# Altium schematic sheet USB-C PD.SchDoc
size A4
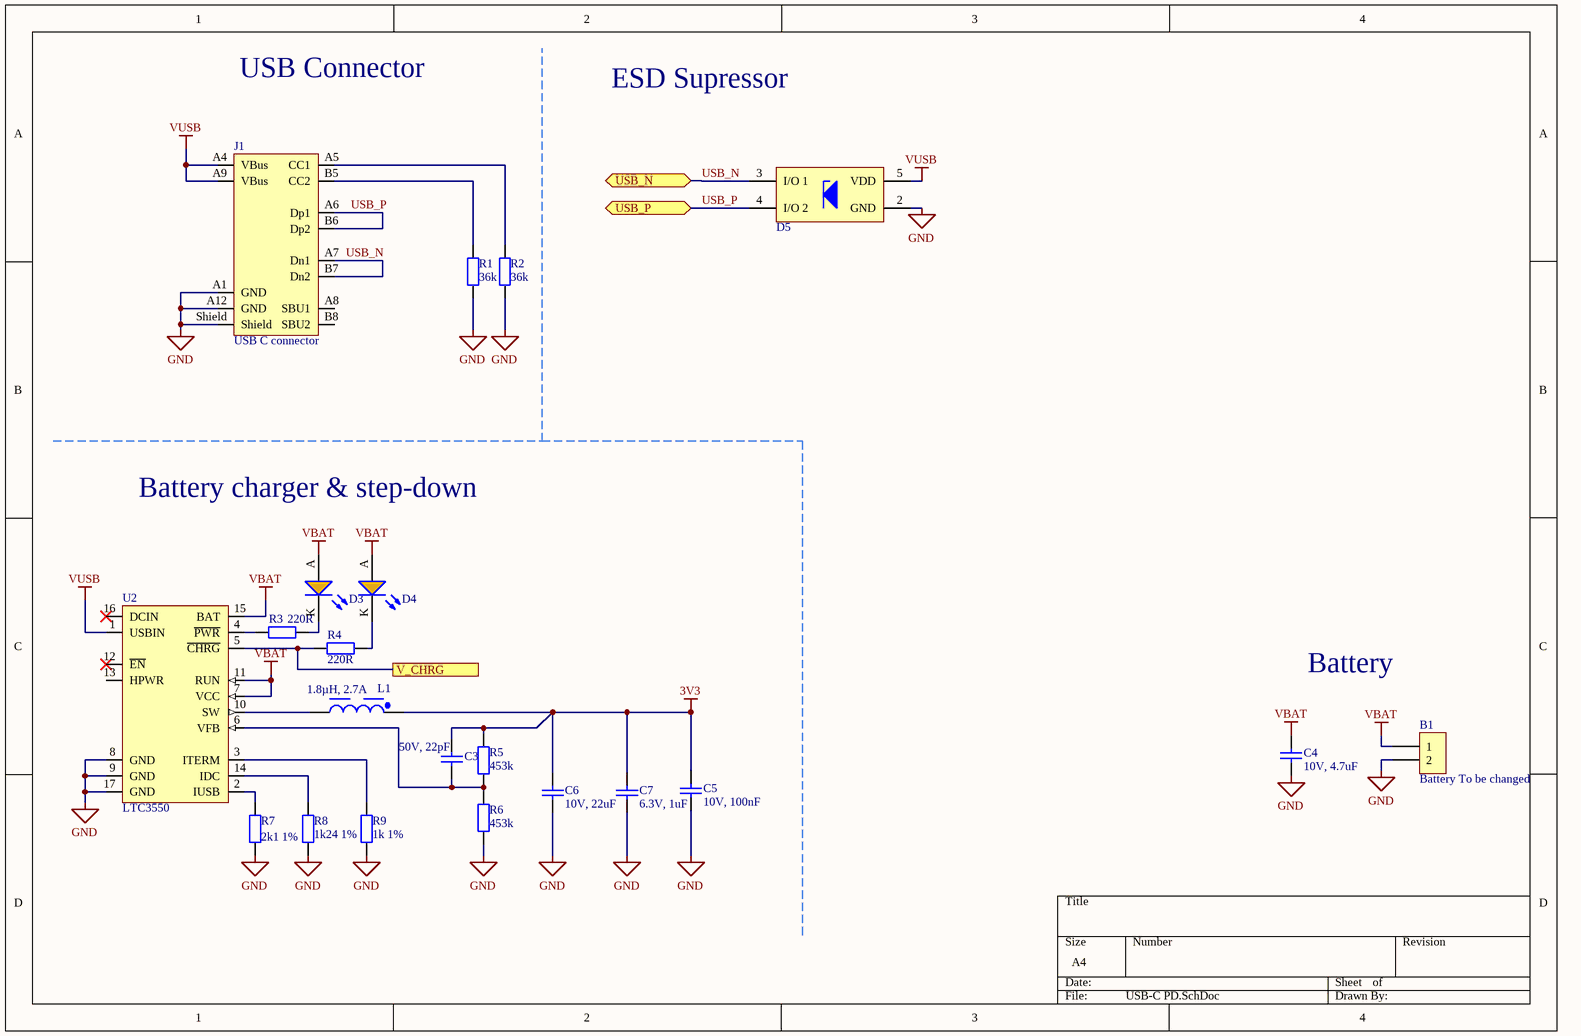
[diagram p0: USB-C PD.SchDoc]

## Parts
B1  Battery To be changed  [letev2]
C3  50V, 22pF  [0402_1x0.5x0.5mm]
C4  10V, 4.7uF  [0603_1.6x0.8x0.8mm_Reflow Soldering]
C5  10V, 100nF  [0603_1.6x0.8x0.8mm_Reflow Soldering]
C6  10V, 22uF  [0805_2x1.25x1.25mm_Reflow Soldering]
C7  6.3V, 1uF  [0603_1.6x0.8x0.8mm_Reflow Soldering]
D3  Amber, 2V, 140°  [WL-SMCW_0603_150060xx75000]  (value not drawn)
D4  Amber, 2V, 140°  [WL-SMCW_0603_150060xx75000]  (value not drawn)
D5  5V  [WE-TVS_SOT23-5L]  (value not drawn)
J1  USB C connector  [USB4105-15-A-120]
L1  1.8µH, 2.7A  [WE-TPC_4828]
R1  value 36k  [R0402]  (hidden comment: Res2-smd)
R2  value 36k  [R0402]  (hidden comment: Res2-smd)
R3  220R  [R0402]
R4  220R  [R0402]
R5  value 453k  [R0402]  (hidden comment: Res2-smd)
R6  value 453k  [R0402]  (hidden comment: Res2-smd)
R7  value 2k1 1%  [R0402]  (hidden comment: Res2-smd)
R8  value 1k24 1%  [R0402]  (hidden comment: Res2-smd)
R9  value 1k 1%  [R0402]  (hidden comment: Res2-smd)
U2  LTC3550  [DHC16 Linear]

## Ports
USB_N (bidir), USB_P (bidir), V_CHRG

## Nets
3V3: C3.2 C5.2 C6.2 C7.2 L1.1 R5.2
GND: B1.2 C4.1 C5.1 C6.1 C7.1 D5.2(GND) J1.A1(GND) J1.A12(GND) J1.Shield R1.1 R2.1 R6.1 R7.1 R8.1 R9.1 U2.8(GND) U2.9(GND) U2.17(GND)
VBAT: B1.1 C4.2 D3.A D4.A U2.7(VCC) U2.11(RUN) U2.15(BAT)
VUSB: D5.5(VDD) J1.A4(VBus) J1.A9(VBus) U2.1(USBIN)
USB_N: D5.3(I/O_1) J1.A7(Dn1) J1.B7(Dn2) ; port USB_N
USB_P: D5.4(I/O_2) J1.A6(Dp1) J1.B6(Dp2) ; port USB_P
V_CHRG: R4.2 U2.5(~{CHRG}) ; port V_CHRG
NetC3_1: C3.1 R5.1 R6.2 U2.6(VFB)
NetD3_K: D3.K R3.1
NetD4_K: D4.K R4.1
NetJ1_A5: J1.A5(CC1) R2.2
NetJ1_B5: J1.B5(CC2) R1.2
NetL1_2: L1.2 U2.10(SW)
NetR3_2: R3.2 U2.4(~{PWR})
NetR7_2: R7.2 U2.2(IUSB)
NetR8_2: R8.2 U2.14(IDC)
NetR9_2: R9.2 U2.3(ITERM)

Not connected (* = marked no-connect by the designer): J1 A8(SBU1) B8(SBU2); U2 12(~{EN})* 13(HPWR) 16(DCIN)*

## Notes on the sheet
- USB Connector
- ESD Supressor
- Battery charger & step-down
- Battery

## Library data of the parts
B1 = header2
C3 = 885012005057: WCAP-CSGP Ceramic Capacitors, 0402, NP0, 50V, 22pF; Rated Voltage: 50V DC; ComponentLink1Description: Manufacturer; ComponentLink1URL: http://www.we-online.de; ComponentLink2Description: Datasheet; ComponentLink2URL: http://katalog.we-online.de/pbs/datasheet/885012005057.pdf; Part Number: 885012005057; Published Date: Oct. 2017; Publisher: Wurth Elektronik; Size: 0402; Operating Temperature: -55 °C to +125 °C; Value: 22pF; Ceramic Type: NP0
C4 = 885012106012: WCAP-CSGP Ceramic Capacitors, 0603, X5R, 10V, 4.7uF; Rated Voltage: 10V DC; ComponentLink1Description: Manufacturer; ComponentLink1URL: http://www.we-online.de; ComponentLink2Description: Datasheet; ComponentLink2URL: http://katalog.we-online.de/pbs/datasheet/885012106012.pdf; Part Number: 885012106012; Published Date: Oct. 2017; Publisher: Wurth Elektronik; Size: 0603; Operating Temperature: -55 °C to +125 °C; Value: 4.7uF; Ceramic Type: X5R
C5 = 885012206020: WCAP-CSGP Ceramic Capacitors, 0603, X7R, 10V, 100nF; Rated Voltage: 10V DC; ComponentLink1Description: Manufacturer; ComponentLink1URL: http://www.we-online.de; ComponentLink2Description: Datasheet; ComponentLink2URL: http://katalog.we-online.de/pbs/datasheet/885012206020.pdf; Part Number: 885012206020; Published Date: Oct. 2017; Publisher: Wurth Elektronik; Size: 0603; Operating Temperature: -55 °C to +125 °C; Value: 100nF; Ceramic Type: X7R
C6 = 885012107011: WCAP-CSGP Ceramic Capacitors, 0805, X5R, 10V, 22uF; Rated Voltage: 10V DC; ComponentLink1Description: Manufacturer; ComponentLink1URL: http://www.we-online.de; ComponentLink2Description: Datasheet; ComponentLink2URL: http://katalog.we-online.de/pbs/datasheet/885012107011.pdf; Part Number: 885012107011; Published Date: Oct. 2017; Publisher: Wurth Elektronik; Size: 0805; Operating Temperature: -55 °C to +125 °C; Value: 22uF; Ceramic Type: X5R
C7 = 885012106003: WCAP-CSGP Ceramic Capacitors, 0603, X5R, 6.3V, 1uF; Rated Voltage: 6.3V DC; ComponentLink1Description: Manufacturer; ComponentLink1URL: http://www.we-online.de; ComponentLink2Description: Datasheet; ComponentLink2URL: http://katalog.we-online.de/pbs/datasheet/885012106003.pdf; Part Number: 885012106003; Published Date: Oct. 2017; Publisher: Wurth Elektronik; Size: 0603; Operating Temperature: -55 °C to +125 °C; Value: 1uF; Ceramic Type: X5R
D3 D4 = 150060AS75000: WL-SMCW Mono-color Chip LED Waterclear, SMT, size 0603, Amber, 2V, 140°; Manufacturer: Wurth Elektronik; Case/Size Code: 0603; Chip Technology: AlInGaP; Dominant Wavelength: 605nm; Luminous Intensity: 130mcd; Peak Wavelength: 610nm; Manufacturer Part Number: 150060AS75000; Category: Signal LEDs; Match Code: WL-SMCW; ComponentLink1Description: Website Link; ComponentLink1URL: https://www.we-online.com/redexpert/article/150060AS75000?ad; ComponentLink2Description: Datasheet Link; ComponentLink2URL: https://www.we-online.com/redexpert/spec/150060AS75000?ad; Mount: Surface Mount; Operating Temperature Max: 85°C; Operating Temperature Min: -40°C; Packaging: Tape and Reel; Length: 1.6mm; Width: 0.8mm; Height: 0.7mm; Emitting Color: Amber; Forward Voltage: 2V; Viewing Angle: 140°
D5 = 824011: WE-TVS TVS Diode – High Speed Series, SOT23-5L, 2+1 Channel, 5V, 2pF; Manufacturer: Wurth Elektronik; Channel ESD Clamping Voltage: 13V; Channel Reverse Leakage Current: 1µA; ESD Air Discharge Capability: 24kV; ESD Contact Discharge Capability: 16kV; Polarity: Unidirectional; (Reverse) Breakdown Voltage: 6.1V; (Reverse) Peak Pulse Current: 13A; ComponentLink1Description: Website Link; ComponentLink1URL: https://www.we-online.com/redexpert/article/824011?ad; ComponentLink2Description: Datasheet Link; ComponentLink2URL: https://www.we-online.com/redexpert/spec/824011?ad; Manufacturer Part Number: 824011; Category: ESD Protection; Match Code: WE-TVS; Mount: Surface Mount; Operating Temperature Max: 125°C; Operating Temperature Min: -55°C; Packaging: Tape and Reel; Case/Size Code: SOT23-5L; Length: 2.9mm; Width: 2.8mm; Height: 1.16mm; Channel Input Capacitance: 2pF; Channel Operating Voltage: 5V; Number of Channels: 2+1
J1 = USB4105-15-A-120
L1 = 7440430018: WE-TPC SMT Tiny Power Inductor, 4828, 1.8µH, 2.7A, 25mΩ; Manufacturer: Wurth Elektronik; Case/Size Code: 4828; DC Resistance: 20mΩ; Saturation Current: 2.45A; Self Resonant Frequency: 120MHz; ComponentLink1Description: Website Link; ComponentLink1URL: https://www.we-online.com/redexpert/article/7440430018?ad; ComponentLink2Description: Datasheet Link; ComponentLink2URL: https://www.we-online.com/redexpert/spec/7440430018?ad; Manufacturer Part Number: 7440430018; Category: Shielded Power Inductors; Match Code: WE-TPC; Mount: Surface Mount; Operating Temperature Max: 125°C; Operating Temperature Min: -40°C; Packaging: Tape and Reel; Length: 4.8mm; Width: 4.8mm; Height: 2.8mm; DC Resistance Max: 25mΩ; Inductance: 1.8µH; Rated Current: 2.7A
R3 R4 = Res 0402
U2 = LTC3550: Dual Input USB/AC Adapter / Li-Ion Battery Charger with / 600mA Buck Converter